# Altium schematic sheet updated_sami_board_v3.SchDoc
size A; SheetNumber: 1; SheetTotal: 1
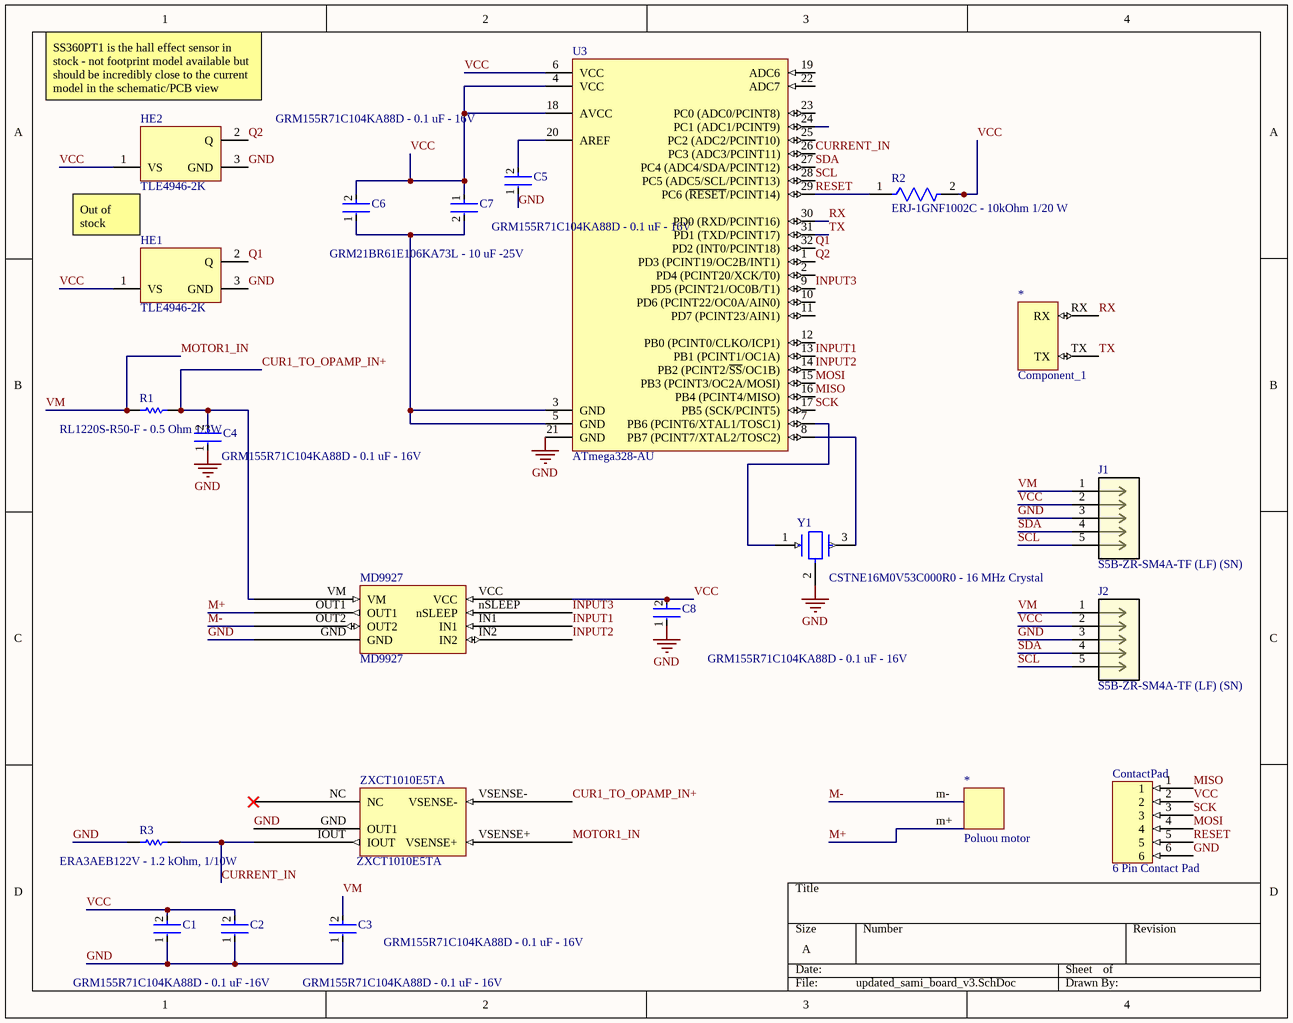
[diagram p0: updated_sami_board_v3.SchDoc]

## Parts
(Parts that share a designator on the sheet are numbered #1, #2 ... from top to bottom, then left to right.)
*#1  Component_1  [UART Header Pins]
*#2  Poluou motor  [PCBComponent_1]
C1  GRM155R71C104KA88D - 0.1 uF -16V  [FP-GRM15-MFG]
C2  GRM155R71C104KA88D - 0.1 uF - 16V  [FP-GRM15-MFG]
C3  GRM155R71C104KA88D - 0.1 uF - 16V  [FP-GRM15-MFG]
C4  GRM155R71C104KA88D - 0.1 uF - 16V  [FP-GRM15-MFG]
C5  GRM155R71C104KA88D - 0.1 uF - 16V  [FP-GRM15-MFG]
C6  GRM155R71C104KA88D - 0.1 uF - 16V  [FP-GRM15-MFG]
C7  GRM21BR61E106KA73L - 10 uF -25V  [FP-GRM21B-0_15-IPC_C]
C8  GRM155R71C104KA88D - 0.1 uF - 16V  [FP-GRM15-MFG]
ContactPad  6 Pin Contact Pad  [6PinContactPad]
HE1  TLE4946-2K  [INF-PG-SC59_M]
HE2  TLE4946-2K  [INF-PG-SC59_M]
J1  S5B-ZR-SM4A-TF (LF) (SN)  [CONN_S5B-ZR-SM4A-TF_JST]
J2  S5B-ZR-SM4A-TF (LF) (SN)  [CONN_S5B-ZR-SM4A-TF_JST]
MD9927  MD9927  [MD9927]
R1  RL1220S-R50-F - 0.5 Ohm 1/3W  [RESC2013X50X40NL20T20]
R2  ERJ-1GNF1002C - 10kOhm 1/20 W  [FP-ERJ1G-MFG]
R3  ERA3AEB122V - 1.2 kOhm, 1/10W  [RESC1608X55X30ML20T20]
U3  ATmega328-AU  [32A_L]
Y1  CSTNE16M0V53C000R0 - 16 MHz Crystal  [FP-CSTNE16M0V53C000R0-MFG]
ZXCT1010E5TA  ZXCT1010E5TA  [ZXCT1010E5TA]

## Nets
GND: C1.1 C2.1 C3.1 C4.1 C5.1 C8.1 ContactPad.6 HE1.3(GND) HE2.3(GND) J1.3 J2.3 MD9927.GND R3.1 U3.21(GND) Y1.2(GND) ZXCT1010E5TA.GND(OUT1)
CUR1_TO_OPAMP_IN+: C4.2 MD9927.VM R1.2 ZXCT1010E5TA.VSENSE-
CURRENT_IN: R3.2 U3.26(PC3_(ADC3/PCINT11)) ZXCT1010E5TA.IOUT
INPUT1: MD9927.IN1 U3.13(PB1_(PCINT1/OC1A))
INPUT2: MD9927.IN2 U3.14(PB2_(PCINT2/~{SS}/OC1B))
INPUT3: MD9927.nSLEEP U3.9(PD5_(PCINT21/OC0B/T1))
M+: *#2.m+ MD9927.OUT1
M-: *#2.m- MD9927.OUT2
MISO: ContactPad.1 U3.16(PB4_(PCINT4/MISO))
MOSI: ContactPad.4 U3.15(PB3_(PCINT3/OC2A/MOSI))
MOTOR1_IN: C3.2 J1.1 J2.1 R1.1 ZXCT1010E5TA.VSENSE+  [also labelled VM]
Q1: HE1.2(Q) U3.32(PD2_(INT0/PCINT18))
Q2: HE2.2(Q) U3.1(PD3_(PCINT19/OC2B/INT1))
RESET: ContactPad.5 R2.1 U3.29(PC6_(~{RESET}/PCINT14))
RX: *#1.RX U3.30(PD0_(RXD/PCINT16))
SCK: ContactPad.3 U3.17(PB5_(SCK/PCINT5))
SCL: J1.5 J2.5 U3.28(PC5_(ADC5/SCL/PCINT13))
SDA: J1.4 J2.4 U3.27(PC4_(ADC4/SDA/PCINT12))
TX: *#1.TX U3.31(PD1_(TXD/PCINT17))
VCC: C1.2 C2.2 C6.2 C7.1 C8.2 ContactPad.2 HE1.1(VS) HE2.1(VS) J1.2 J2.2 MD9927.VCC R2.2 U3.4(VCC) U3.6(VCC) U3.18(AVCC)
NetC5_2: C5.2 U3.20(AREF)
NetC6_1: C6.1 C7.2 U3.3(GND) U3.5(GND)
NetU3_7: U3.7(PB6_(PCINT6/XTAL1/TOSC1)) Y1.1(Input)
NetU3_8: U3.8(PB7_(PCINT7/XTAL2/TOSC2)) Y1.3(Output)

Not connected (* = marked no-connect by the designer): U3 2(PD4_(PCINT20/XCK/T0)) 10(PD6_(PCINT22/OC0A/AIN0)) 11(PD7_(PCINT23/AIN1)) 12(PB0_(PCINT0/CLKO/ICP1)) 19(ADC6) 22(ADC7) 23(PC0_(ADC0/PCINT8)) 24(PC1_(ADC1/PCINT9)) 25(PC2_(ADC2/PCINT10)); ZXCT1010E5TA NC*

## Notes on the sheet
- (near HE2) SS360PT1 is the hall effect sensor in stock - not footprint model available but should be incredibly close to the current model in the schematic/PCB view
- Out of stock

## Library data of the parts
C1-C6 C8 = CMP-2100-03641-2: CAP CER 0.1UF 16V X7R 0402; Manufacturer: Murata; Standoff Height: 0mm; Tolerance: 10%; Voltage Rating: 16Vdc; Material: Ceramic; Capacitance: 0.10μF; Value: 0.10μF; RoHS: TRUE; Manufacturer Part Number: GRM155R71C104KA88D; Temperature Characteristic: X7R; Octopart: https://octopart.com/grm155r71c104ka88d-murata-196880; Digikey Description: CAP CER 0.1UF 16V X7R 0402; Device Class L3: Ceramic Capacitors; Height: 0.55mm; ComponentLink2Description: Datasheet; Temperature Range Low: -55°C; Ipc Land Pattern Name: CAPC10050X219; ComponentLink2URL: https://search.murata.co.jp/Ceramy/image/img/A01X/G101/ENG/GRM155R71H471KA01-01A.pdf; Device Class L1: Passive Components; Lead Free: yes; Category: Cap; Package: GRM15; Temperature: -55°C to +125°C; Device Class L2: Capacitors; Temperature Range High: +125°C; Mouser Description: 0402 0.1 uF 16V ±10 % Tolerance X7R SMT Multilayer Ceramic Capacitor
C7 = CMP-2007-03541-2: Chip Multilayer Ceramic Capacitors for General Purpose, 0805, 10uF, X5R, 15%, 10%, 25V; Length: 2mm; Depth: 1.25mm; Termination: SMD/SMT; Voltage: 25V; Height: 1.25mm; Material: Ceramic; Thickness: 0.053inch; Radiation Hardening: No; Min Operating Temperature: -55°C; Width: 0.049inch; Package Quantity: 1; Mount: Surface Mount; Dielectric: X5R; Packaging: Tape and Reel; Capacitance: 10uF; Voltage Rating (DC): 25V; Lead Free: Lead Free; Max Operating Temperature: 85°C; Case Code (Imperial): 0805; Case/Package: 0805; Tolerance: 10%; Voltage Rating: 25V; Case Code (Metric): 2012
HE1 HE2 = CMP-1148-00006-1: High Precision Hall Effect Latch, PG-SC59, Reel, Green; Manufacturer: Infineon; Brp (25degreesC) typ: -2Â mT; Target Application: Automotive; Interface: open collector; Chopped Hall Technology: TRUE; Bhyst (25degreesC) max: 4Â mT; Direction Detection: FALSE; Bop (25degreesC) min: 2Â mT; ComponentLink3URL: http://www.infineon.com/dgdl/SC59-Package_Overview.pdf?folderId=db3a30431936bc4b01194dc0d34440b0&fileId=db3a30431936bc4b01194dd1aa1d40cf; PackageReference: PG-SC59; ComponentLink1URL: http://www.infineon.com/; Type: Latch; Packing: Reel; PartNumber: TLE4946-2K; Mounting Technology: Surface Mount; ComponentLink2URL: http://www.infineon.com/dgdl/TLE4946-2K_DS_Rev1.pdf?folderId=db3a30431f848401011facc1c83b4674&fileId=db3a30431f848401011fbc925c48637f; DatasheetVersion: Rev. 1.0; PackageVersion: Mar-08; PackageDescription: 3-Pin Semiconductor Package, 3 x 1.53 mm Body, 0.95 mm Pitch; ComponentLink3Description: Package Specification; ComponentLink1Description: Manufacturer URL; ComponentLink2Description: Datasheet; Green: TRUE
J1 J2 = S5B-ZR-SM4A-TF (LF) (SN): No Description Available; Mfr_Name: JST; Copyright: Copyright (C) 2021 Ultra Librarian. All rights reserved.; Manufacturer_Part_Number: S5B-ZR-SM4A-TF (LF) (SN); RefDes: RefDes; Type: DEV
R1 = CMP-2001-03168-1: Manufacturer: Susumu; Part Number: RL1220S-R50-F
R2 = CMP-2004-03445-2: RES SMD 10K OHM 1% 1/20W 0201; Manufacturer: Panasonic Electronic Components; Power Rating: 0.05W; Voltage Rating: 25V; Resistance: 10kΩ; Automotive Grade: Grade 1; Value: 10kΩ; Temperature Coefficient: 200ppm/°C; Temperature: -55°C to +125°C; Manufacturer Part Number: ERJ-1GNF1002C; Footprint Url: https://industrial.panasonic.com/cdbs/www-data/pdf/RDA0000/DMA0000COL17.pdf; Digikey Description: RES SMD 10K OHM 1% 1/20W 0201; ComponentLink2URL: https://industrial.panasonic.com/cdbs/www-data/pdf/RDA0000/AOA0000C304.pdf; Octopart: https://octopart.com/erj-1gnf1002c-panasonic-55419697; Height: 0.26mm; Temperature Range High: +125°C; Composition: Thick Film; ComponentLink2Description: Datasheet; Device Class L2: Resistors; Temperature Range Low: -55°C; Device Class L3: Chip SMD Resistors; Package: ERJ1G; Lead Free: Yes; Automotive: Yes; Category: Res; Device Class L1: Passive Components; Tolerance: 1%; Mouser Description: Thick Film Resistors - SMD 0201 10Kohm 1% HalogenFree AEC-Q200; Series: ERJ; RoHS: TRUE
R3 = CMP-2000-00897-1: Manufacturer: Panasonic; Part Number: ERA3AEB122V
U3 = CMP-0095-00261-2: 8-bit AVR Microcontroller, 32KB Flash, 1KB EEPROM, 2KB SRAM, 32-pin TQFP, Industrial Grade (-40°C to 85°C); DatasheetVersion: revD, May-2011; ComponentLink3Description: ATmega48A/48PA/88A/88PA/168A/168PA/328/328P Summary; Code_JEDEC: MS-026-ABA; ComponentLink1URL: http://www.atmel.com/; RevisionNote: DatasheetVersion & PackageVersion updated. URLs added.; ComponentLink2Description: ATmega48A/48PA/88A/88PA/168A/168PA/328/328P Datasheet; ComponentLink1Description: Manufacturer URL; ComponentLink2URL: http://www.atmel.com/dyn/resources/prod_documents/doc8271.pdf; PackageReference: 32A; ComponentLink3URL: http://www.atmel.com/dyn/resources/prod_documents/8271S.pdf; PackageDescription: 32-Lead, 7x7x1.0 mm Body, 0.8mm Lead Pitch, Thin Profile Plastic Quad Flat Package (TQFP); PackageVersion: revC, Oct-2010
Y1 = CMP-06057-000009-1: CERAMIC RES 16.0000MHZ 15PF SMD; Impedance: 40R; Frequency Stability: 0.15%; Frequency: 16MHz; Frequency Tolerance: 0.5%; Capacitance: 15pF; Resistor Type: Ceramic; Min Operating Temperature: -40°C; Case/Package: SMD/SMT; Packaging: Tape and Reel; Max Operating Temperature: 125°C; Mount: Surface Mount